# EAGLE design PayloadStandingV15 (EAGLE 9.0.0)
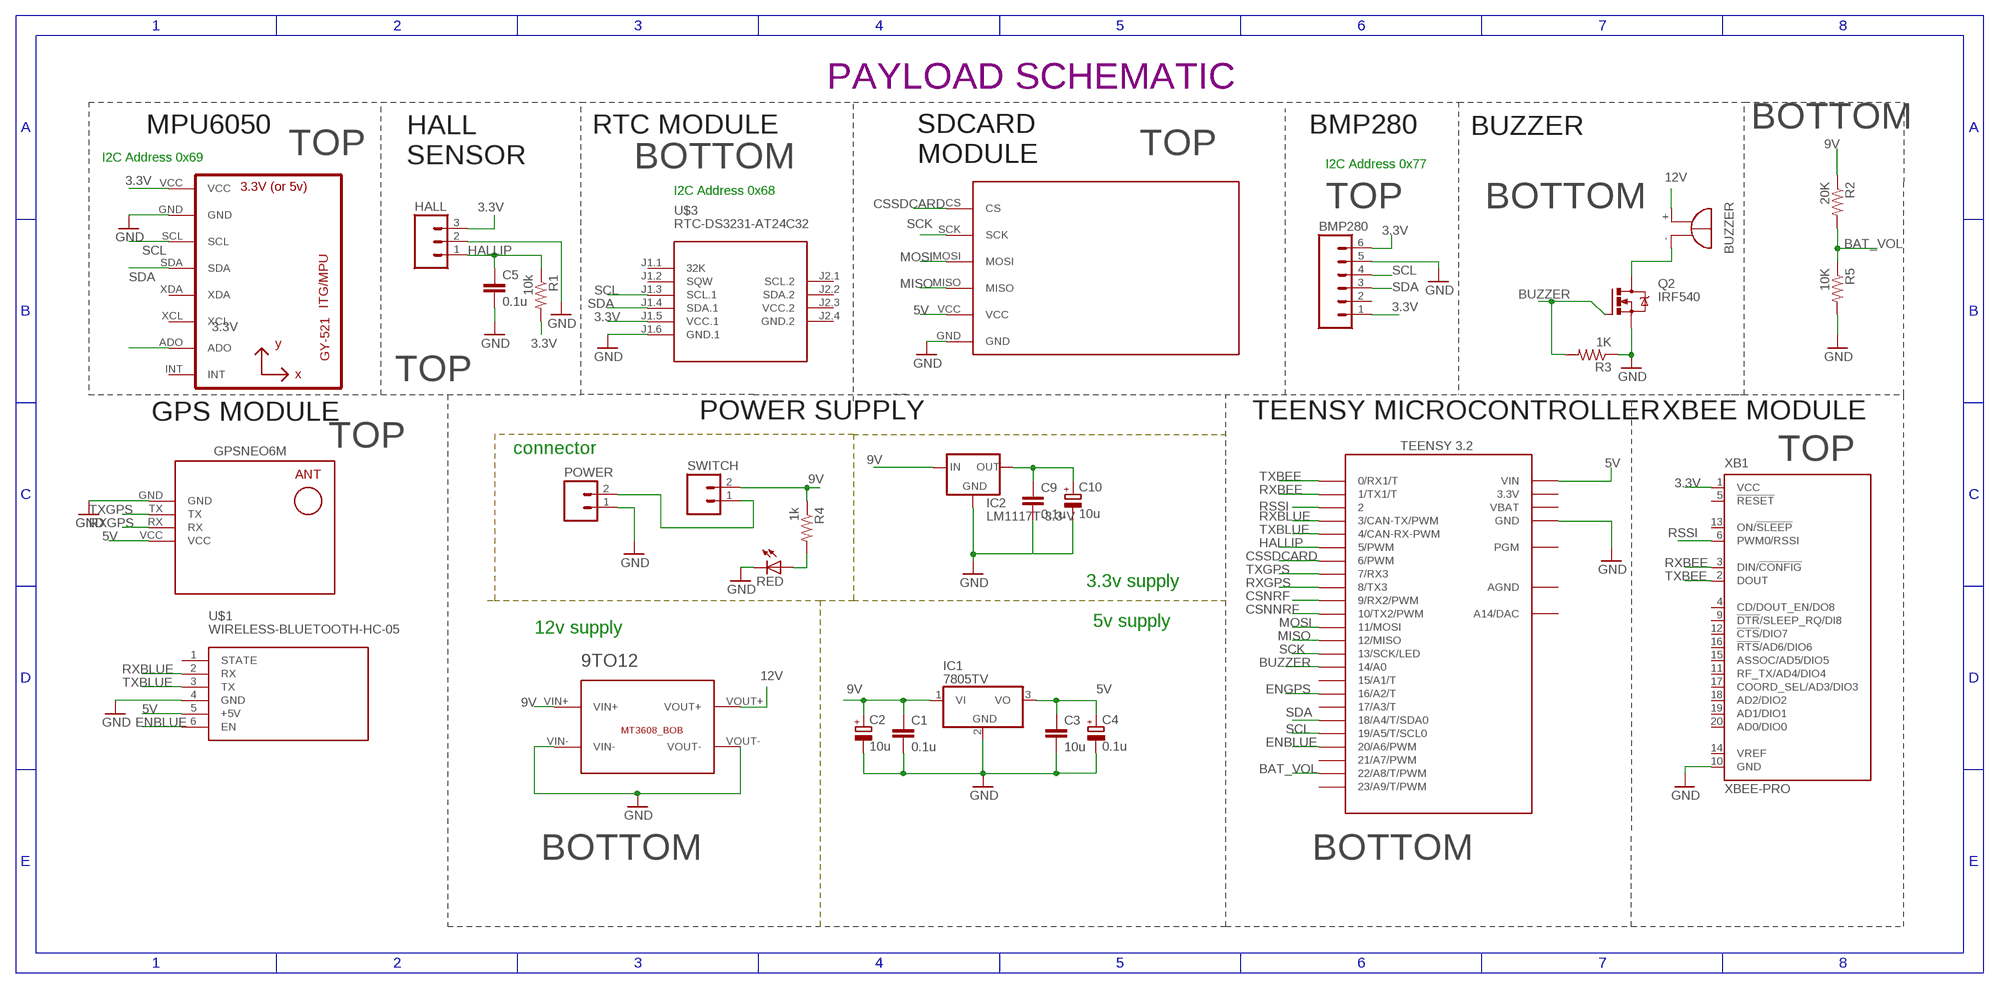
[diagram p0: schematic, sheet 1]

## Parts
9TO12  BREAKOUTS_MT3608_BOB  [BREAKOUTS_MT3608_BOB]
BMP280  M06  [06P]
C1  0.1u  C-EU025-025X050  [C025-025X050]
C2  10u  CPOL-EUE2.5-6  [E2,5-6]
C3  10u  C-EU025-025X050  [C025-025X050]
C4  0.1u  CPOL-EUE2.5-6  [E2,5-6]
C5  0.1u  C-EU025-025X050  [C025-025X050]
C9  0.1u  C-EU025-025X050  [C025-025X050]
C10  10u  CPOL-EUE2.5-6  [E2,5-6]
HALL  M03  [03P]
IC1  7805TV  [TO220V]
IC2  LM1117T-3.3-V  [TO220V]
POWER  CEDT_JANUARY_2015_V5_M02  [CEDT_JANUARY_2015_V5_02P]
Q2  IRF540  [TO220BV]
R1  10k  R-US_0204/7  [0204/7]
R2  20K  R-US_0204/7  [0204/7]
R3  1K  R-US_0204/7  [0204/7]
R4  1k  R-US_0204/7  [0204/7]
R5  10K  R-US_0204/7  [0204/7]
RED  red  LED3MM  [LED3MM]
SG1  BUZZER_EB2209A  [BUZZER_EB2209A]
SWITCH  M02  [02P]
U1  GY-521MPU6050  [GY-521]
U$1  WIRELESS-BLUETOOTH-HC-05  [WIRELESS-BLUETOOTH-HC-05]
U$2  TEENSY_3.1-3.2_OUTER_ROW  [TEENSY_3.0-3.2&LC_OUTER_ROW]
U$3  RTC-DS3231-AT24C32  [RTC-DS3231-AT24C32]
U$4  GPS-RECEIVER-NEO6M  [GPS-RECEIVER-NEO6M]
U$5  SDCARD  [M0SDCARDMODULE]
XB1  XBEE-PRO  [XBEE-PRO]

## Nets
3.3V [power]: BMP280.1 BMP280.6 C9.1 C10.+ HALL.3 IC2.2(OUT) R1.2 U1.ADO U1.VCC U$3.J1.5(VCC.1) XB1.1(VCC)
5V [power]: C3.1 C4.+ IC1.3(VO) U$1.5(+5V) U$2.VIN U$4.VCC U$5.VCC
9V [power]: 9TO12.VIN+ C1.1 C2.+ IC1.1(VI) IC2.3(IN) R2.1 R4.1 SWITCH.2
12V [power]: 9TO12.VOUT+ SG1.+
BAT_VOL: R2.2 R5.1 U$2.22/A8(22/A8/T/PWM)
BUZZER: Q2.G R3.2 U$2.14/A0
CSNNRF: U$2.10(10/TX2/PWM)
CSNRF: U$2.9(9/RX2/PWM)
CSSDCARD: U$2.6(6/PWM) U$5.CS
ENBLUE: U$1.6(EN) U$2.20/A6(20/A6/PWM)
ENGPS: U$2.16/A2(16/A2/T)
GND [power]: 9TO12.VIN- 9TO12.VOUT- BMP280.5 C1.2 C2.- C3.2 C4.- C5.2 C9.2 C10.- HALL.2 IC1.2(GND) IC2.1(GND) POWER.1 Q2.S R3.1 R5.2 RED.K(C) U1.GND U$1.4(GND) U$2.GND U$2.GND1(GND) U$3.J1.6(GND.1) U$4.GND U$5.GND XB1.10(GND)
HALLIP: C5.1 HALL.1 R1.1 U$2.5(5/PWM)
MISO: U$2.12(12/MISO) U$5.MISO
MOSI: U$2.11(11/MOSI) U$5.MOSI
N$1 [power]: POWER.2 SWITCH.1
N$2: R4.2 RED.A
N$3 [power]: Q2.D SG1.-
RSSI: U$2.2 XB1.6(PWM0/RSSI)
RXBEE: U$2.1(1/TX1/T) XB1.3(DIN/!CONFIG)
RXBLUE: U$1.2(RX) U$2.3(3/CAN-TX/PWM)
RXGPS: U$2.8(8/TX3) U$4.RX
SCK: U$2.13(13/SCK/LED) U$5.SCK
SCL: BMP280.4 U1.SCL U$2.19/A5(19/A5/T/SCL0) U$3.J1.3(SCL.1)
SDA: BMP280.3 U1.SDA U$2.18/A4(18/A4/T/SDA0) U$3.J1.4(SDA.1)
TXBEE: U$2.0(0/RX1/T) XB1.2(DOUT)
TXBLUE: U$1.3(TX) U$2.4(4/CAN-RX-PWM)
TXGPS: U$2.7(7/RX3) U$4.TX
Unconnected: BMP280.2 U1.INT U1.XCL U1.XDA U$1.1(STATE) U$2.15/A1(15/A1/T) U$2.17/A3(17/A3/T) U$2.21/A7(21/A7/PWM) U$2.23/A9(23/A9/T/PWM) U$2.PGM U$2.RESET/DAC(A14/DAC) U$3.J1.1(32K) U$3.J1.2(SQW) U$3.J2.1(SCL.2) U$3.J2.2(SDA.2) XB1.4(CD/DOUT_EN/DO8) XB1.5(!RESET) XB1.9(!DTR!/SLEEP_RQ/DI8) XB1.11(RF_TX/AD4/DIO4) XB1.12(!CTS!/DIO7) XB1.13(ON/!SLEEP) XB1.14(VREF) XB1.15(ASSOC/AD5/DIO5) XB1.16(!RTS!/AD6/DIO6) XB1.17(COORD_SEL/AD3/DIO3) XB1.18(AD2/DIO2) XB1.19(AD1/DIO1) XB1.20(AD0/DIO0)

## Notes on the sheet
- PAYLOAD SCHEMATIC
- MPU6050 | RTC MODULE | BMP280 | BUZZER | BOTTOM
- TOP | TOP
- I2C Address 0x69
- SDCARD
  MODULE
- HALL
  SENSOR
- BOTTOM | I2C Address 0x77
- I2C Address 0x68
- TOP | BOTTOM
- TOP
- GPS MODULE | POWER SUPPLY | TEENSY MICROCONTROLLER | XBEE MODULE
- TOP
- connector
- TOP
- 3.3v supply
- 5v supply
- 12v supply
- BOTTOM | BOTTOM

## Power pins joined to a net without a drawn wire
3.3V: U$2.3.3V U$2.3.3V1(3.3V)
AGND: U$2.AGND
GND.2: U$3.J2.4(GND.2)
VBAT: U$2.VBAT
VCC.2: U$3.J2.3(VCC.2)

## Library data of the parts
9TO12 = Cansat2019_3279_Container_v01:BREAKOUTS_MT3608_BOB
BMP280 = con-amp-quick:M06: AMP QUICK CONNECTOR; OC_FARNELL: unknown; OC_NEWARK: unknown
C1 C3 C5 C9 = resistor:C-EU: CAPACITOR, European symbol
C2 C4 C10 = rcl:CPOL-EU: POLARIZED CAPACITOR, European symbol; SPICEPREFIX: C
HALL = con-amp-quick:M03: AMP QUICK CONNECTOR; OC_FARNELL: unknown; OC_NEWARK: unknown
IC1 = linear:78*: Positive VOLTAGE REGULATOR Source: http://cache.national.com/ds/LM/LM78L05.pdf http://www.fairchildsemi.com/ds/LM/LM7805.pdf
IC2 = lm1117:LM1117T-*
POWER = Cansat2019_3279_Container_v01:CEDT_JANUARY_2015_V5_M02: AMP QUICK CONNECTOR
Q2 = transistor-power:IRF540: HEXFET Power MOSFET
R1-R5 = rcl:R-US_: RESISTOR, American symbol; SPICEPREFIX: R
RED = CEDT_JANUARY_2015_v5:LED
SG1 = Cansat2019_3279_Container_v01:BUZZER_EB2209A: BUZZER Source: Buerklin; OC_FARNELL: unknown; OC_NEWARK: unknown
SWITCH = CEDT_JANUARY_2015_v5:M02: AMP QUICK CONNECTOR
U1 = gy-521:GY-521
U$1 = diy-modules(1):WIRELESS-BLUETOOTH-HC-05: Bluetooth Transceiver Module based on HC-05 board Tutorial is available here: https://arduino-info.wikispaces.com/BlueTooth-HC05-HC06-Modules-How-To Click here to find device on ebay.com <http://www.ebay.com/sch/hc-05+module+rs232>
U$2 = Teensy_3_and_LC_Series_Boards_v1.4:TEENSY_3.1-3.2_OUTER_ROW: Footprint for Teensy 3.1 or 3.2 board using all pin connections on the outer perimeter
U$3 = diy-modules:RTC-DS3231-AT24C32: RTC Module with Battery and EEPROM based on DS3231 and AT24C32 chips Tutorial can be found here: https://edwardmallon.wordpress.com/2014/05/21/using-a-cheap-3-ds3231-rtc-at24c32-eeprom-from-ebay/ Click here to find device on ebay.com <http://www.ebay.com/sch/DS3231+AT24C32+module>
U$4 = diy-modules:GPS-RECEIVER-NEO6M: GPS Receiver Module based on NEO-6 device Short tutorial how to use NEO-6 module with Arduino: http://www.xarg.org/2016/06/neo6mv2-gps-module-with-arduino/ NEO-6 datasheet is available here: https://www.u-blox.com/sites/default/files/products/documents/NEO-6_DataSheet_%28GPS.G6-HW-09005%29.pdf Click here to find device on ebay.com <http://www.ebay.com/sch/gyneo6mv2>
U$5 = mylib:SDCARD
XB1 = maxstream:XBEE: XBee (TM) /XBee-PRO(TM) OEM RF Modules Source: MaxStream, Inc. xbee_productmanual.pdf; MPN: XBP24-AWI-001; OC_FARNELL: 1337916; OC_NEWARK: 42M2667

## Net classes
0 default: width 0.508 mm
1 power: width 0.61 mm

## Board
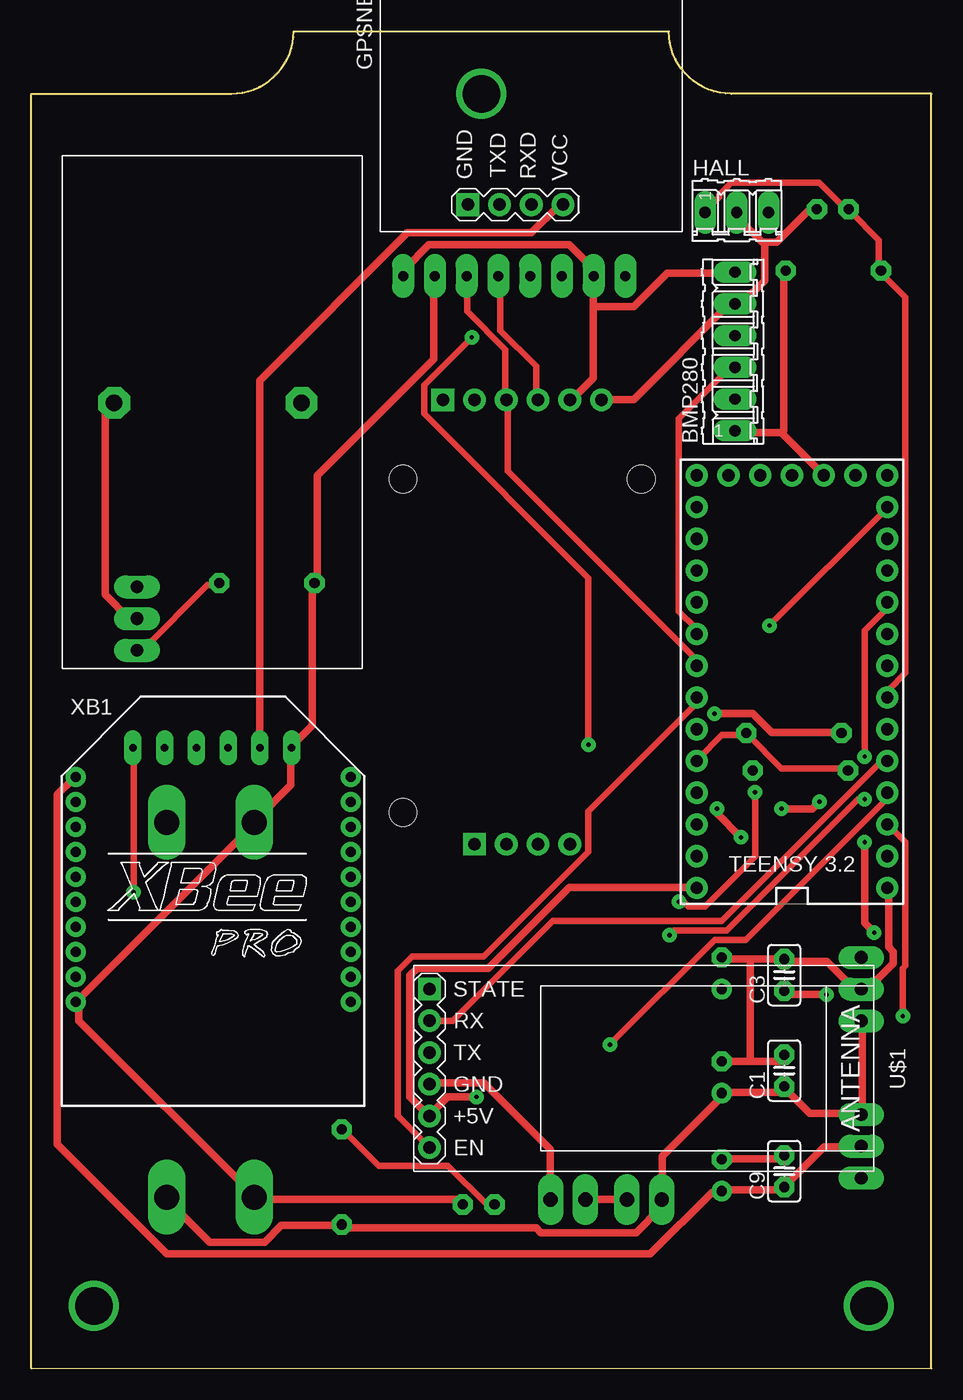
[diagram p1: board, top side]
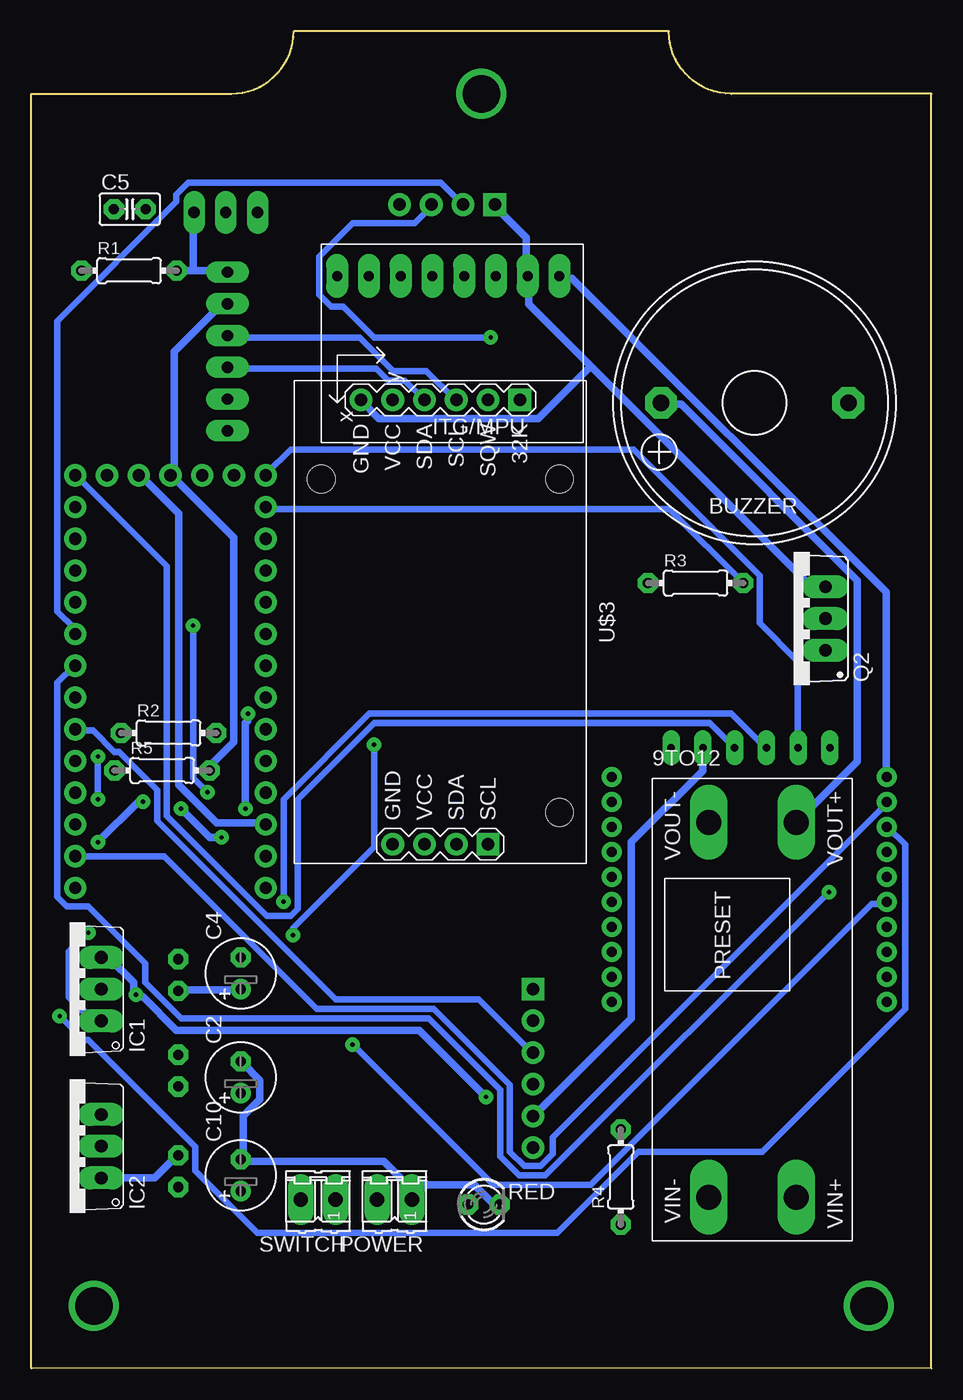
[diagram p2: board, bottom side, seen from below]

Size 72 x 107 mm. Coordinates in mm from the lower left corner, seen from the top.
Outline: 0,0 72,0 72,102 56,102 arc-90 51,107 21,107 arc-90 16,102 0,102 0,0
Copper layers (1*16): Top 0.035mm / dielectric 1.5mm / Bottom 0.035mm
Design rules "default *": minimum track width 6mil, minimum drill 0.35mm, track to track 10mil, track to pad 10mil, pad to pad 10mil, via to via 10mil, smd to smd 10mil, copper to edge 40mil, drill to drill 6mil, minimum pad ring 16mil, minimum via ring 16mil, stop-mask expansion 4mil, vias tented up to drill 0mil, thermal gap 10mil

### Footprints (pad centres in the part's own frame; a part is rotated, then mirrored left to right if it is on the bottom)
BREAKOUTS_MT3608_BOB = drill 2 pad 3 long: VIN+ 33.5,-4.5; VIN- 33.5,-11.5; VOUT+ 3.5,-4.5; VOUT- 3.5,-11.5
06P = drill 0.914 long: 1 -6.35,0; 2 -3.81,0; 3 -1.27,0; 4 1.27,0; 5 3.81,0; 6 6.35,0
C025-025X050 = drill 0.813 octagon: 1 -1.27,0; 2 1.27,0
E2,5-6 = drill 0.813 pad 1.6: + -1.27,0 | drill 0.813 pad 1.6 octagon: - 1.27,0
03P = drill 0.914 long: 1 -2.54,0; 2 0,0; 3 2.54,0
TO220V = drill 1.016 long: 1 -2.54,-2.54; 2 0,-2.54; 3 2.54,-2.54
CEDT_JANUARY_2015_V5_02P = drill 1.143 long: 1 -1.397,0; 2 1.397,0
TO220BV = drill 1.016 long: D 0,-2.54; G -2.54,-2.54; S 2.54,-2.54
0204/7 = drill 0.813 octagon: 1 -3.81,0; 2 3.81,0
LED3MM = drill 0.813 octagon: A -1.27,0; K 1.27,0
BUZZER_EB2209A = drill 1.321 pad 2.54 octagon: + 7.493,0; - -7.493,0
02P = drill 1.143 long: 1 -1.397,0; 2 1.397,0
GY-521 = drill 0.8 pad 1.778 long: ADO -8.89,-6.35; GND -8.89,6.35; INT -8.89,-8.89; SCL -8.89,3.81; SDA -8.89,1.27; VCC -8.89,8.89; XCL -8.89,-3.81; XDA -8.89,-1.27
WIRELESS-BLUETOOTH-HC-05 = drill 1 square: 1 -6.35,-17.145 | drill 1: 2 -3.81,-17.145; 3 -1.27,-17.145; 4 1.27,-17.145; 5 3.81,-17.145; 6 6.35,-17.145
TEENSY_3.0-3.2&LC_OUTER_ROW = drill 0.965: 0 -7.62,13.97; 1 -7.62,11.43; 2 -7.62,8.89; 3 -7.62,6.35; 3.3V 7.62,11.43; 3.3V1 -2.54,-16.51; 4 -7.62,3.81; 5 -7.62,1.27; 6 -7.62,-1.27; 7 -7.62,-3.81; 8 -7.62,-6.35; 9 -7.62,-8.89; 10 -7.62,-11.43; 11 -7.62,-13.97; 12 -7.62,-16.51; 13 7.62,-16.51; 14/A0 7.62,-13.97; 15/A1 7.62,-11.43; 16/A2 7.62,-8.89; 17/A3 7.62,-6.35; 18/A4 7.62,-3.81; 19/A5 7.62,-1.27; 20/A6 7.62,1.27; 21/A7 7.62,3.81; 22/A8 7.62,6.35; 23/A9 7.62,8.89; AGND 7.62,13.97; GND -7.62,16.51; GND1 0,-16.51; PGM 2.54,-16.51; RESET/DAC 5.08,-16.51; VBAT -5.08,-16.51; VIN 7.62,16.51
RTC-DS3231-AT24C32 = drill 1 square: J1.1 -17.78,6.35; J2.1 17.78,3.81 | drill 1: J1.2 -17.78,3.81; J1.3 -17.78,1.27; J1.4 -17.78,-1.27; J1.5 -17.78,-3.81; J1.6 -17.78,-6.35; J2.2 17.78,1.27; J2.3 17.78,-1.27; J2.4 17.78,-3.81 | hole 2.2: -11.43,-9.525; -11.43,9.525; 15.24,9.525
GPS-RECEIVER-NEO6M = drill 1 square: GND -15.875,5.08 | drill 1: RX -15.875,0; TX -15.875,2.54; VCC -15.875,-2.54
M0SDCARDMODULE = drill 0.6 long: CS -6.35,6.35; GND -6.35,-6.35; MISO -6.35,-1.27; MOSI -6.35,1.27; SCK -6.35,3.81; VCC -6.35,-3.81
XBEE-PRO = drill 0.8 pad 1.27: 1 -11,9; 2 -11,7; 3 -11,5; 4 -11,3; 5 -11,1; 6 -11,-1; 7 -11,-3; 8 -11,-5; 9 -11,-7; 10 -11,-9; 11 11,-9; 12 11,-7; 13 11,-5; 14 11,-3; 15 11,-1; 16 11,1; 17 11,3; 18 11,5; 19 11,7; 20 11,9

### Placement (x,y rotation side)
9TO12  6.32,47.2 270 bottom
BMP280  56.29,81.37 90 top
C1  60.24,23.82 90 top
C2  55.24,23.29 90 bottom
C3  60.24,31.47 90 top
C4  55.24,31.61 90 bottom
C5  64.12,92.76 0 bottom
C9  60.24,15.77 90 top
C10  55.24,15.45 90 bottom
HALL  56.44,92.49 0 top
IC1  68.94,30.34 90 bottom
IC2  68.94,17.77 90 bottom
POWER  42.94,13.51 180 bottom
Q2  11,60 90 bottom
R1  64.17,87.84 0 bottom
R2  61.01,50.84 0 bottom
R3  18.85,62.84 0 bottom
R4  24.84,15.31 90 bottom
R5  61.53,47.84 0 bottom
RED  35.79,13.11 0 bottom
SG1  14.13,77.26 180 bottom
SWITCH  49.05,13.51 180 bottom
U1  38.64,78.53 270 bottom
U$1  49,24 270 top
U$2  60.86,54.95 180 top
U$3  39.27,59.72 270 bottom
U$4  40,109 90 top
U$5  14.47,56.02 90 top
XB1  14.55,38.32 0 top

### Tracks (layer width: path | path; a pad name or v marks a point on that pad's centre or on a via)
3.3V
  Top 0.61: 44.96,84.96 44.96,79.25 43.24,77.53 U$3.J1.5 | 44.96,84.96 44.96,87.25 U1.ADO 44.77,87.63 44.77,88.2 43.05,89.92 31.81,89.92 29.91,88.01 29.91,87.44 U1.VCC | 44.96,84.96 48.2,84.96 50.86,87.63 56.2,87.63 BMP280.6 | 60.01,74.87 56.39,74.87 BMP280.1 | 60.01,74.87 63.25,71.63 U$2.3.3V1 | R1.2 60.2,87.82 60.2,75.06 60.01,74.87 | IC2.2 66.29,17.72 63.44,17.72 60.39,14.67 C9.1 60.2,14.48 60.01,14.29 55.24,14.29 C10.+ 55.05,14.1 54.48,14.1 49.53,9.14 10.86,9.14 2.1,17.91 2.1,45.91 3.43,47.24 XB1.1
  Bottom 0.61: 59.05,87.82 56.39,87.82 BMP280.6 | 59.05,87.82 60.2,87.82 R1.2 | 59.05,87.82 59.05,92.39 HALL.3 | U$2.3.3V 53.34,43.62 57.15,43.62 60.2,46.67 60.2,68.39 63.25,71.44 U$2.3.3V1 | XB1.1 3.62,47.43 3.62,62.1 28.77,87.25 29.72,87.25 U1.VCC
5V  (via drill 0.35)
  Top 0.61: v63.63,29.91 60.58,29.91 60.39,30.1 C3.1 | U$2.VIN 53.15,38.48 43.05,38.48 36.58,32 30.86,32 30.29,31.43 30.29,21.72 31.81,20.19 U$1.5 32,20.38 33.34,21.72 v35.62,21.72 | U$4.VCC 42.48,92.96 42.1,92.96 40.01,90.87 30.1,90.87 18.29,79.06 18.29,49.72 U$5.VCC
  Bottom 0.61: C4.+ 55.24,30.29 60.2,30.29 C3.1 | IC1.3 66.29,32.77 65.72,32.77 63.82,30.86 63.82,30.1 v63.63,29.91 63.44,29.72 63.06,29.72 60.39,27.05 40.96,27.05 v35.62,21.72 | U$5.VCC 18.29,49.53 18.29,47.82 24,42.1 24,28 31.81,20.19 U$1.5
9V  (via drill 0.35)
  Top 0.61: v54.67,52.39 57.72,52.39 59.24,50.86 64.77,50.86 R2.1 | v54.86,44.77 54.86,44.39 v56.77,42.48 | v60.01,44.77 62.48,44.77 v63.06,45.34 | v66.67,42.1 66.67,35.62 v67.44,34.86 | 9TO12.VIN+ 10.86,13.53 14.29,10.1 18.67,10.1 20,11.43 24.77,11.43 R4.1 24.96,11.24 40.39,11.24 40.77,10.86 48.39,10.86 50.29,12.76 50.29,13.34 SWITCH.2 50.48,13.53 50.48,16.95 55.24,21.72 C2.+ 55.24,22.1 59.82,22.1 60.2,22.48 C1.1 60.39,22.29 62.29,20.38 66.29,20.38 IC2.3 66.48,20.57 66.48,27.62 IC1.1
  Bottom 0.61: v54.67,52.39 54.67,51.82 54.86,51.63 v54.86,44.77 | v56.77,42.48 57.72,42.48 v60.01,44.77 | v63.06,45.34 63.44,45.34 v66.67,42.1 | v67.44,34.86 68.96,33.34 68.96,29.72 67.06,27.81 66.48,27.81 IC1.1
12V
  Bottom 0.61: SG1.+ 21.53,77.15 20,77.15 5.91,63.06 5.91,48.58 10.67,43.81 9TO12.VOUT+
BAT_VOL
  Top 0.508: U$2.22/A8 53.34,48.77 55.24,50.67 57.15,50.67 R2.2 57.34,50.67 60.01,48.01 65.15,48.01 R5.1
BUZZER
  Top 0.508: R3.2 14.86,62.67 14.1,62.67 8.95,57.53 8.57,57.53 Q2.G
  Bottom 0.508: U$2.14/A0 53.15,68.77 20.95,68.77 15.05,62.87 R3.2
CSSDCARD  (via drill 0.35)
  Top 0.508: v8.19,38.1 8.19,49.53 U$5.CS
  Bottom 0.508: v8.19,38.1 30.86,15.43 32.96,15.43 34.48,16.95 34.48,22.29 40.2,28 60.01,28 62.87,30.86 62.87,32.38 67.44,36.96 69.15,36.96 69.91,37.72 69.91,54.86 68.58,56.2 U$2.6
ENBLUE
  Top 0.508: U$2.20/A6 53.15,53.53 53.15,53.15 44.58,44.58 44.58,41.34 36.2,32.96 30.48,32.96 29.34,31.81 29.34,20.19 31.81,17.72 U$1.6
GND
  Top 0.61: 58.67,90.11 58.48,90.11 56.58,92.01 56.58,92.39 HALL.2 | 58.67,90.11 59.63,90.11 62.1,92.58 62.67,92.58 C5.2 | 58.67,90.11 58.67,87.06 56.96,85.34 56.39,85.34 BMP280.5 56.01,85.15 55.82,85.15 48.2,77.53 45.72,77.53 U$3.J1.6 | C10.- 55.24,16.76 60.01,16.76 60.2,16.95 C9.2 | 57.53,24.57 59.82,24.57 60.2,24.96 C1.2 | 57.53,24.57 55.24,24.57 C2.- | 57.53,32.77 55.24,32.77 C4.- | 57.53,32.77 60.2,32.77 C3.2 60.39,32.58 63.63,32.58 65.91,30.29 66.1,30.29 IC1.2 66.48,30.48 67.06,30.48 68.96,32.38 68.96,33.34 68.58,33.72 68.58,38.29 U$2.GND | 57.53,32.77 57.53,24.57 | U$1.4 32,22.86 36.2,22.86 41.53,17.53 41.53,13.53 POWER.1 | RED.K 34.48,13.14 34.1,13.53 17.91,13.53 9TO12.VIN- 17.72,13.91 3.81,27.81 3.81,29.15 XB1.10 3.62,29.34 17.72,43.43 9TO12.VOUT- 17.91,43.81 20.77,46.67 20.77,49.53 U$5.GND 20.95,49.91 22.48,51.44 22.48,62.67 R3.1 22.86,63.06 22.86,71.44 32.19,80.77 32.19,87.25 U1.GND
  Bottom 0.61: U$4.GND 34.86,92.96 32.38,90.49 32.38,87.44 U1.GND 32.19,87.25 32.19,85.15 27.24,80.2 | 27.24,80.2 9.72,62.67 8.57,62.67 Q2.S | R5.2 57.53,48.01 57.53,48.39 55.82,50.1 55.82,66.48 60.77,71.44 U$2.GND1 60.58,71.63 60.58,81.34 56.77,85.15 56.39,85.15 BMP280.5 | 27.24,80.2 31.43,76.01 44.2,76.01 45.53,77.34 U$3.J1.6 | IC2.1 66.29,15.24 62.1,15.24 60.39,16.95 C9.2 | C2.- 55.05,24.38 53.72,23.05 53.72,21.53 55.05,20.19 55.05,16.76 C10.- 54.86,16.57 43.81,16.57 41.34,14.1 POWER.1 41.53,13.53 40.39,14.67 36.58,14.67 35.05,13.14 34.67,13.14 RED.K
HALLIP
  Top 0.508: HALL.1 53.91,92.58 55.05,93.73 55.05,93.92 56.01,94.87 63.06,94.87 65.15,92.77 C5.1 65.53,92.58 67.82,90.3 67.82,88.01 R1.1 68.01,87.63 69.91,85.72 69.91,55.63 68.58,54.29 68.58,53.72 U$2.5
MISO
  Bottom 0.508: U$5.MISO 15.81,49.72 17.72,51.63 44.58,51.63 50.67,45.53 50.67,36.77 51.24,36.2 53.15,36.2 61.15,44.2 61.15,64.2 68.39,71.44 U$2.12
MOSI  (via drill 0.35)
  Top 0.508: v51.82,37.34 52.2,37.34 52.58,36.96 53.91,36.96 57.91,40.96 v57.91,46.1 | v59.05,59.44 68.39,68.77 U$2.11
  Bottom 0.508: v51.82,37.34 51.82,45.53 44.96,52.39 16,52.39 13.34,49.72 U$5.MOSI | v57.91,46.1 59.05,47.24 v59.05,59.44
N$1
  Top 0.61: POWER.2 44.39,13.53 47.62,13.53 SWITCH.1
N$2
  Top 0.508: RED.A 36.96,13.14 36.39,13.14 33.34,16.19 27.81,16.19 24.96,19.05 R4.2
N$3
  Top 0.61: Q2.D 8.38,60.01 7.81,60.01 5.91,61.91 5.91,76.58 6.48,77.15 SG1.-
N$4  (via drill 3)
  other vias: 67,5
N$5  (via drill 3)
  other vias: 5,5
N$6  (via drill 3)
  other vias: 36,102
RSSI  (via drill 0.35)
  Top 0.508: v46.29,25.91 54.67,34.29 57.15,34.29 68.39,45.53 68.39,45.91 U$2.2
  Bottom 0.508: v46.29,25.91 35.05,14.67 27.24,14.67 4.76,37.15 3.62,37.15 XB1.6
RXBEE  (via drill 0.35)
  Top 0.508: v69.72,28.19 69.72,32 69.91,32.19 69.91,42.1 68.58,43.43 U$2.1
  Bottom 0.508: v69.72,28.19 67.82,26.29 67.44,26.29 58.86,17.72 58.86,15.81 53.91,10.86 29.91,10.86 23.43,17.34 13.53,17.34 2.1,28.77 2.1,41.91 3.43,43.24 XB1.3
RXBLUE
  Top 0.508: U$2.3 68.39,48.58 68.01,48.58 55.24,35.81 41.72,35.81 33.72,27.81 32,27.81 U$1.2
RXGPS  (via drill 0.35)
  Top 0.508: v66.67,48.96 66.67,59.05 68.39,60.77 68.39,61.15 U$2.8 | v66.67,45.53 66.1,45.53 55.63,35.05 51.44,35.05 v51.05,34.67 | v44.58,49.91 44.58,63.25 31.43,76.39 31.43,78.68 v35.24,82.49
  Bottom 0.508: v66.67,45.53 v66.67,48.96 | v51.05,34.67 51.05,35.24 44.58,41.72 v44.58,49.91 | v35.24,82.49 44.58,82.49 47.05,84.96 48.01,84.96 48.96,85.92 48.96,88.96 46.29,91.63 41.34,91.63 40.01,92.96 U$4.RX
SCK
  Bottom 0.508: U$5.SCK 10.67,49.72 10.67,56.58 13.72,59.63 13.72,63.44 23.81,73.53 51.24,73.53 53.15,71.63 U$2.13
SCL
  Top 0.508: U1.SCL 34.86,87.25 34.86,84.58 37.91,81.53 37.91,77.53 U$3.J1.3 38.1,77.34 38.1,71.82 53.15,56.77 53.15,56.39 U$2.19/A5
  Bottom 0.508: BMP280.4 56.2,82.49 45.72,82.49 43.05,79.82 40.39,79.82 38.1,77.53 U$3.J1.3
SDA
  Top 0.508: U1.SDA 37.53,87.25 37.53,83.06 40.39,80.2 40.39,77.53 U$3.J1.4 | U$2.18/A4 53.15,58.86 53.15,59.24 51.82,60.58 51.82,76.01 55.82,80.01 56.2,80.01 BMP280.3
  Bottom 0.508: BMP280.3 56.2,80.01 44.39,80.01 43.43,79.06 42.1,79.06 40.58,77.53 U$3.J1.4
TXBEE
  Bottom 0.508: XB1.2 3.62,45.15 30.29,18.48 30.29,17.14 31.24,16.19 32.58,16.19 33.72,17.34 33.72,22.67 39.81,28.77 49.15,28.77 61.34,40.96 68.39,40.96 U$2.0
TXBLUE
  Bottom 0.508: U$2.4 68.39,51.05 67.06,51.05 65.34,49.34 64.96,49.34 61.91,46.29 61.91,43.81 47.62,29.53 36.2,29.53 32,25.34 U$1.3
TXGPS
  Bottom 0.508: U$2.7 68.58,58.86 68.58,59.24 69.91,60.58 69.91,83.82 60.39,93.34 60.39,93.92 59.44,94.87 39.24,94.87 37.53,93.15 U$4.TX